# Altium schematic sheet 功耗测试工装原理图1.SchDoc
size A3
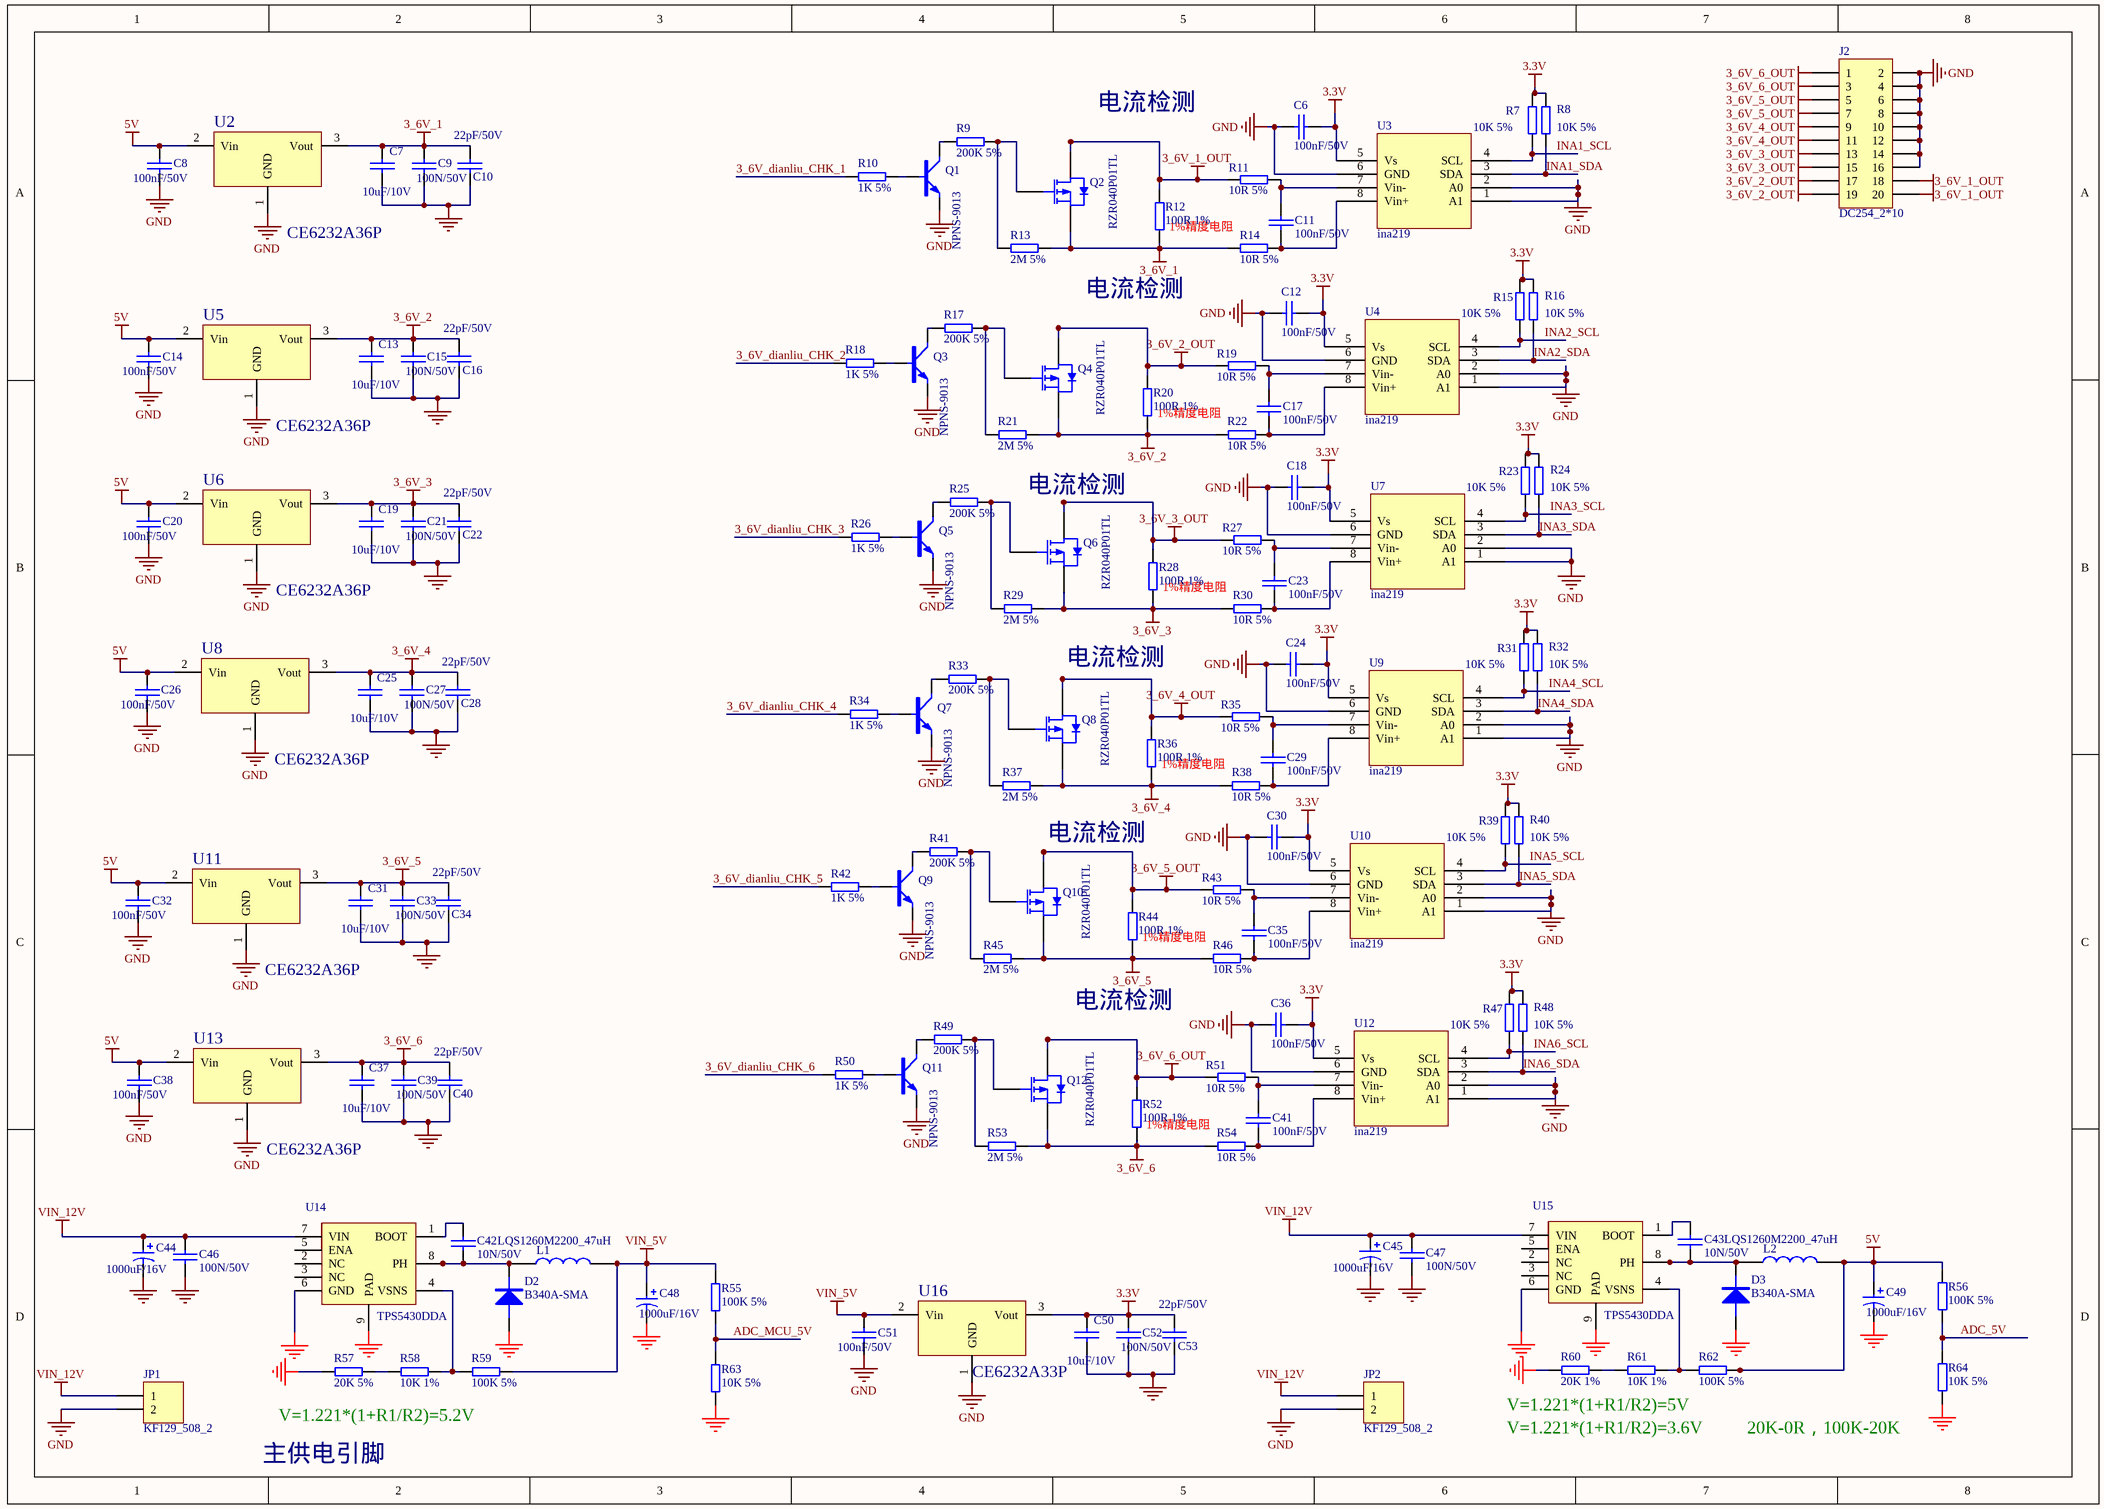
[diagram p0: 功耗测试工装原理图1.SchDoc]

## Parts
C6  100nF/50V  [CAP0603]
C7  10uF/10V  [CAP0603]
C8  100nF/50V  [CAP0603]
C9  100N/50V  [CAP0603]
C10  22pF/50V  [CAP0603]
C11  100nF/50V  [CAP0603]
C12  100nF/50V  [CAP0603]
C13  10uF/10V  [CAP0603]
C14  100nF/50V  [CAP0603]
C15  100N/50V  [CAP0603]
C16  22pF/50V  [CAP0603]
C17  100nF/50V  [CAP0603]
C18  100nF/50V  [CAP0603]
C19  10uF/10V  [CAP0603]
C20  100nF/50V  [CAP0603]
C21  100N/50V  [CAP0603]
C22  22pF/50V  [CAP0603]
C23  100nF/50V  [CAP0603]
C24  100nF/50V  [CAP0603]
C25  10uF/10V  [CAP0603]
C26  100nF/50V  [CAP0603]
C27  100N/50V  [CAP0603]
C28  22pF/50V  [CAP0603]
C29  100nF/50V  [CAP0603]
C30  100nF/50V  [CAP0603]
C31  10uF/10V  [CAP0603]
C32  100nF/50V  [CAP0603]
C33  100N/50V  [CAP0603]
C34  22pF/50V  [CAP0603]
C35  100nF/50V  [CAP0603]
C36  100nF/50V  [CAP0603]
C37  10uF/10V  [CAP0603]
C38  100nF/50V  [CAP0603]
C39  100N/50V  [CAP0603]
C40  22pF/50V  [CAP0603]
C41  100nF/50V  [CAP0603]
C42  10N/50V  [CAP0603]
C43  10N/50V  [CAP0603]
C44  1000uF/16V  [CAPPC_350_800_1600]
C45  1000uF/16V  [CAPPC_350_800_1600]
C46  100N/50V  [CAP0603]
C47  100N/50V  [CAP0603]
C48  1000uF/16V  [CAPPC_350_800_1600]
C49  1000uF/16V  [CAPPC_350_800_1600]
C50  10uF/10V  [CAP0603]
C51  100nF/50V  [CAP0603]
C52  100N/50V  [CAP0603]
C53  22pF/50V  [CAP0603]
D2  B340A-SMA  [DO-214AC]
D3  B340A-SMA  [DO-214AC]
J2  DC254_2*10  [DC254_2*10]
JP1  KF129_508_2  [KF129_508_2]
JP2  KF129_508_2  [KF129_508_2]
L1  LQS1260M2200_47uH  [LQS1212]
L2  LQS1260M2200_47uH  [LQS1212]
Q1  NPNS-9013  [SOT-23]
Q2  RZR040P01TL  [SOT-23]
Q3  NPNS-9013  [SOT-23]
Q4  RZR040P01TL  [SOT-23]
Q5  NPNS-9013  [SOT-23]
Q6  RZR040P01TL  [SOT-23]
Q7  NPNS-9013  [SOT-23]
Q8  RZR040P01TL  [SOT-23]
Q9  NPNS-9013  [SOT-23]
Q10  RZR040P01TL  [SOT-23]
Q11  NPNS-9013  [SOT-23]
Q12  RZR040P01TL  [SOT-23]
R7  10K 5%  [RES0603]
R8  10K 5%  [RES0603]
R9  200K 5%  [RES0603]
R10  1K 5%  [RES0603]
R11  10R 5%  [RES0603]
R12  100R 1%  [RES0603]
R13  2M 5%  [RES0603]
R14  10R 5%  [RES0603]
R15  10K 5%  [RES0603]
R16  10K 5%  [RES0603]
R17  200K 5%  [RES0603]
R18  1K 5%  [RES0603]
R19  10R 5%  [RES0603]
R20  100R 1%  [RES0603]
R21  2M 5%  [RES0603]
R22  10R 5%  [RES0603]
R23  10K 5%  [RES0603]
R24  10K 5%  [RES0603]
R25  200K 5%  [RES0603]
R26  1K 5%  [RES0603]
R27  10R 5%  [RES0603]
R28  100R 1%  [RES0603]
R29  2M 5%  [RES0603]
R30  10R 5%  [RES0603]
R31  10K 5%  [RES0603]
R32  10K 5%  [RES0603]
R33  200K 5%  [RES0603]
R34  1K 5%  [RES0603]
R35  10R 5%  [RES0603]
R36  100R 1%  [RES0603]
R37  2M 5%  [RES0603]
R38  10R 5%  [RES0603]
R39  10K 5%  [RES0603]
R40  10K 5%  [RES0603]
R41  200K 5%  [RES0603]
R42  1K 5%  [RES0603]
R43  10R 5%  [RES0603]
R44  100R 1%  [RES0603]
R45  2M 5%  [RES0603]
R46  10R 5%  [RES0603]
R47  10K 5%  [RES0603]
R48  10K 5%  [RES0603]
R49  200K 5%  [RES0603]
R50  1K 5%  [RES0603]
R51  10R 5%  [RES0603]
R52  100R 1%  [RES0603]
R53  2M 5%  [RES0603]
R54  10R 5%  [RES0603]
R55  100K 5%  [RES0603]
R56  100K 5%  [RES0603]
R57  20K 5%  [RES0603]
R58  10K 1%  [RES0603]
R59  100K 5%  [RES0603]
R60  20K 1%  [RES0603]
R61  10K 1%  [RES0603]
R62  100K 5%  [RES0603]
R63  10K 5%  [RES0603]
R64  10K 5%  [RES0603]
U2  CE6232A36P  [SOT-89]
U3  ina219  [SO-8]
U4  ina219  [SO-8]
U5  CE6232A36P  [SOT-89]
U6  CE6232A36P  [SOT-89]
U7  ina219  [SO-8]
U8  CE6232A36P  [SOT-89]
U9  ina219  [SO-8]
U10  ina219  [SO-8]
U11  CE6232A36P  [SOT-89]
U12  ina219  [SO-8]
U13  CE6232A36P  [SOT-89]
U14  TPS5430DDA  [SOP-8-P]
U15  TPS5430DDA  [SOP-8-P]
U16  CE6232A33P  [SOT-89]

## Nets
3.3V: C6.2 C12.2 C18.2 C24.2 C30.2 C36.2 C50.1 C52.1 C53.1 R7.1 R8.1 R15.1 R16.1 R23.1 R24.1 R31.1 R32.1 R39.1 R40.1 R47.1 R48.1 U3.5(Vs) U4.5(Vs) U7.5(Vs) U9.5(Vs) U10.5(Vs) U12.5(Vs) U16.3(Vout)
3_6V_1: C7.1 C9.1 C10.1 Q2.2(S) R12.1 R13.2 R14.1 U2.3(Vout)
3_6V_1_OUT: J2.18 J2.20 Q2.3(D) R11.1 R12.2
3_6V_2: C13.1 C15.1 C16.1 Q4.2(S) R20.1 R21.2 R22.1 U5.3(Vout)
3_6V_2_OUT: J2.17 J2.19 Q4.3(D) R19.1 R20.2
3_6V_3: C19.1 C21.1 C22.1 Q6.2(S) R28.1 R29.2 R30.1 U6.3(Vout)
3_6V_3_OUT: J2.13 J2.15 Q6.3(D) R27.1 R28.2
3_6V_4: C25.1 C27.1 C28.1 Q8.2(S) R36.1 R37.2 R38.1 U8.3(Vout)
3_6V_4_OUT: J2.9 J2.11 Q8.3(D) R35.1 R36.2
3_6V_5: C31.1 C33.1 C34.1 Q10.2(S) R44.1 R45.2 R46.1 U11.3(Vout)
3_6V_5_OUT: J2.5 J2.7 Q10.3(D) R43.1 R44.2
3_6V_6: C37.1 C39.1 C40.1 Q12.2(S) R52.1 R53.2 R54.1 U13.3(Vout)
3_6V_6_OUT: J2.1 J2.3 Q12.3(D) R51.1 R52.2
5V: C8.1 C14.1 C20.1 C26.1 C32.1 C38.1 C49.1 L2.2 R56.2 R62.2 U2.2(Vin) U5.2(Vin) U6.2(Vin) U8.2(Vin) U11.2(Vin) U13.2(Vin)
GND: C6.1 C7.2 C8.2 C9.2 C10.2 C12.1 C13.2 C14.2 C15.2 C16.2 C18.1 C19.2 C20.2 C21.2 C22.2 C24.1 C25.2 C26.2 C27.2 C28.2 C30.1 C31.2 C32.2 C33.2 C34.2 C36.1 C37.2 C38.2 C39.2 C40.2 C44.2 C45.2 C46.2 C47.2 C48.2 C49.2 C50.2 C51.2 C52.2 C53.2 D2.1 D3.1 J2.2 J2.4 J2.6 J2.8 J2.10 J2.12 J2.14 J2.16 JP1.2 JP2.2 Q1.2(E) Q3.2(E) Q5.2(E) Q7.2(E) Q9.2(E) Q11.2(E) R57.1 R60.1 R63.1 R64.1 U2.1(GND) U3.1(A1) U3.2(A0) U3.6(GND) U4.1(A1) U4.2(A0) U4.6(GND) U5.1(GND) U6.1(GND) U7.1(A1) U7.2(A0) U7.6(GND) U8.1(GND) U9.1(A1) U9.2(A0) U9.6(GND) U10.1(A1) U10.2(A0) U10.6(GND) U11.1(GND) U12.1(A1) U12.2(A0) U12.6(GND) U13.1(GND) U14.6(GND) U14.9(PAD) U15.6(GND) U15.9(PAD) U16.1(GND)
VIN_5V: C48.1 C51.1 L1.2 R55.2 R59.2 U16.2(Vin)
VIN_12V: C44.1 C45.1 C46.1 C47.1 JP1.1 JP2.1 U14.7(VIN) U15.7(VIN)
3_6V_dianliu_CHK_1: R10.2
3_6V_dianliu_CHK_2: R18.2
3_6V_dianliu_CHK_3: R26.2
3_6V_dianliu_CHK_4: R34.2
3_6V_dianliu_CHK_5: R42.2
3_6V_dianliu_CHK_6: R50.2
ADC_5V: R56.1 R64.2
ADC_MCU_5V: R55.1 R63.2
INA1_SCL: R7.2 U3.4(SCL)
INA1_SDA: R8.2 U3.3(SDA)
INA2_SCL: R15.2 U4.4(SCL)
INA2_SDA: R16.2 U4.3(SDA)
INA3_SCL: R23.2 U7.4(SCL)
INA3_SDA: R24.2 U7.3(SDA)
INA4_SCL: R31.2 U9.4(SCL)
INA4_SDA: R32.2 U9.3(SDA)
INA5_SCL: R39.2 U10.4(SCL)
INA5_SDA: R40.2 U10.3(SDA)
INA6_SCL: R47.2 U12.4(SCL)
INA6_SDA: R48.2 U12.3(SDA)
NetC11_1: C11.1 R11.2 U3.7(Vin-)
NetC11_2: C11.2 R14.2 U3.8(Vin+)
NetC17_1: C17.1 R19.2 U4.7(Vin-)
NetC17_2: C17.2 R22.2 U4.8(Vin+)
NetC23_1: C23.1 R27.2 U7.7(Vin-)
NetC23_2: C23.2 R30.2 U7.8(Vin+)
NetC29_1: C29.1 R35.2 U9.7(Vin-)
NetC29_2: C29.2 R38.2 U9.8(Vin+)
NetC35_1: C35.1 R43.2 U10.7(Vin-)
NetC35_2: C35.2 R46.2 U10.8(Vin+)
NetC41_1: C41.1 R51.2 U12.7(Vin-)
NetC41_2: C41.2 R54.2 U12.8(Vin+)
NetC42_1: C42.1 D2.2 L1.1 U14.8(PH)
NetC42_2: C42.2 U14.1(BOOT)
NetC43_1: C43.1 D3.2 L2.1 U15.8(PH)
NetC43_2: C43.2 U15.1(BOOT)
NetQ1_1: Q1.1(B) R10.1
NetQ1_3: Q1.3(C) R9.2
NetQ2_1: Q2.1(G) R9.1 R13.1
NetQ3_1: Q3.1(B) R18.1
NetQ3_3: Q3.3(C) R17.2
NetQ4_1: Q4.1(G) R17.1 R21.1
NetQ5_1: Q5.1(B) R26.1
NetQ5_3: Q5.3(C) R25.2
NetQ6_1: Q6.1(G) R25.1 R29.1
NetQ7_1: Q7.1(B) R34.1
NetQ7_3: Q7.3(C) R33.2
NetQ8_1: Q8.1(G) R33.1 R37.1
NetQ9_1: Q9.1(B) R42.1
NetQ9_3: Q9.3(C) R41.2
NetQ10_1: Q10.1(G) R41.1 R45.1
NetQ11_1: Q11.1(B) R50.1
NetQ11_3: Q11.3(C) R49.2
NetQ12_1: Q12.1(G) R49.1 R53.1
NetR57_2: R57.2 R58.1
NetR58_2: R58.2 R59.1 U14.4(VSNS)
NetR60_2: R60.2 R61.1
NetR61_2: R61.2 R62.1 U15.4(VSNS)

Not connected (* = marked no-connect by the designer): U14 2(NC) 3(NC) 5(ENA); U15 2(NC) 3(NC) 5(ENA)

## Notes on the sheet
- 电流检测
- (near R12) 1%精度电阻
- (near R20) 1%精度电阻
- (near R28) 1%精度电阻
- (near R36) 1%精度电阻
- (near R44) 1%精度电阻
- (near R52) 1%精度电阻
- 主供电引脚
- V=1.221*(1+R1/R2)=5.2V
- V=1.221*(1+R1/R2)=5V
- V=1.221*(1+R1/R2)=3.6V
- 20K-0R，100K-20K

## Library data of the parts
C6 C8 C11 C12 C14 C17 C18 C20 C23 C24 C26 C29 C30 C32 C35 C36 C38 C41 C51 = 101020103-0021: 104pF,50 V,±10%,0603,国巨,CC0603KRX7R9BB104; Part Name: 0603贴片电容; ID: 3; SMD/DIP: SMD; Part Number: 101020103-0021
C7 C13 C19 C25 C31 C37 C50 = 101020103-0026: 106pF,10 V,±10%,0603,村田,GRM188R61A106KE47D; Part Name: 0603贴片电容; ID: 8; SMD/DIP: SMD; Part Number: 101020103-0026
C9 C15 C21 C27 C33 C39 C46 C47 C52 = 101020103-0021: 100N/50V，±10%，0603; Part Name: 0603贴片电容; ID: 34; Part Number: 101020103-0021
C10 C16 C22 C28 C34 C40 C53 = 101020103-0009: 22pF,50 V,±5%,0603,国巨,CC0603JRNPO9BN22; Part Name: 0603贴片电容; ID: 16; SMD/DIP: SMD; Part Number: 101020103-0009
C42 C43 = 101020103-0007: 10N/50V，±10%，0603; Part Name: 0603贴片电容; ID: 35; Part Number: 101020103-0007
C44 C45 C48 C49 = 1010203-0029: 1000uF,16 V,±20%,8*20mm,Rubycon,16ZLH1000M; Part Name: 电解电容; ID: 2; SMD/DIP: DIP; Part Number: 1010203-0029
D2 D3 = 101040101-0014: Part Name: 贴片肖特基; ID: 24; Part Number: 101040101-0014
J2 = 1010902-0139: DC2 2.54mm 2x10pin,2.54mm间距，2x10pin，32×8.55×27.5mm,母头,双排,双排牛角座; Part Name: DC牛角座; ID: 4; SMD/DIP: DIP; Part Number: 1010902-0139
JP1 JP2 = 1010904-0015: KF129-2P,螺丝紧固,2,ABS,松涛; Part Name: 接线端子; ID: 7; SMD/DIP: DIP; Part Number: 1010904-0015
L1 L2 = 1010302-0007: 47uH/2.2A,±20%，0.072Ω，L1200X1200X600; Part Name: 贴片电感; ID: 3; Part Number: 1010302-0007
Q1 Q3 Q5 Q7 Q9 Q11 = 101040201-0002: 9013,NPN,SOT-23,长电,S9013; Part Name: 贴片三极管; ID: 15; SMD/DIP: SMD; Part Number: 101040201-0002
Q2 Q4 Q6 Q8 Q10 Q12 = 101040201-0010: RZR040P01TL；1.5v导通,P-MOS,SOT-23,罗姆,RZR040P01TL; Part Name: PMOS管; ID: 18; SMD/DIP: SMD; Part Number: 101040201-0010
R7 R8 R15 R16 R23 R24 R31 R32 R39 R40 R47 R48 = 101010103-0003: 国巨,±5%,0603,,155 ℃,-55 ℃,RC0603JR-0710KL,无铅,200 ppm/℃,1/10W,,10K; Part Name: 0603贴片电阻; ID: 7; SMD/DIP: SMD; Part Number: 101010103-0003
R9 R17 R25 R33 R41 R49 = 101010103-0034: 200K,±5%,1/10W,0603,国巨,RC0603JR-07200KL; Part Name: 0603贴片电阻; ID: 13; SMD/DIP: SMD; Part Number: 101010103-0034
R10 R18 R26 R34 R42 R50 = 101010103-0008: 1K,±5%,1/10W,0603,国巨,RC0603JR-071KL; Part Name: 0603贴片电阻; ID: 10; SMD/DIP: SMD; Part Number: 101010103-0008
R11 R14 R19 R22 R27 R30 R35 R38 R43 R46 R51 R54 = 101010103-0017: 10R,±5%,1/10W,0603,国巨,RC0603JR-0710RL; Part Name: 0603贴片电阻; ID: 8; SMD/DIP: SMD; Part Number: 101010103-0017
R12 R20 R28 R36 R44 R52 = 101010103-0041: 100Ω,±1%,1/10W,0603,国巨股份有限公司,RC0603FR-07100RL; Part Name: 0603贴片电阻; ID: 4; SMD/DIP: SMD; Part Number: 101010103-0041
R13 R21 R29 R37 R45 R53 = 101010103-0025: 国巨,±5%,0603,,155 ℃,-55 ℃,RC0603JR-072ML,含铅,100 ppm/℃,1/10W,,2M; Part Name: 0603贴片电阻; ID: 20; SMD/DIP: SMD; Part Number: 101010103-0025
R55 R56 R63 R64 = 101010103-0005: 100K±5%,1/10W,0603; Part Name: 0603贴片电阻; ID: 30; Part Number: 101010103-0005
R57 = 101010103-0004: 国巨,±5%,0603,,155 ℃,-55 ℃,RC0603JR-0720KL,无铅,200 ppm/℃,1/10W,,20K; Part Name: 0603贴片电阻; ID: 15; SMD/DIP: SMD; Part Number: 101010103-0004
R58 R61 = 101010103-0053: 8.2k±1%,1/10W,0603; Part Name: 0603贴片电阻; ID: 142; Part Number: 101010103-0053
R59 R62 = 101010103-0005: 国巨,±5%,0603,,155 ℃,-55 ℃,RC0603JR-07100KL,无铅,100 ppm/℃,1/10W,,100K; Part Name: 0603贴片电阻; ID: 3; SMD/DIP: SMD; Part Number: 101010103-0005
R60 = 101010103-0048: 20K,±1%,1/10W,0603,国巨,RC0603FR-0720KL; Part Name: 0603贴片电阻; ID: 14; SMD/DIP: SMD; Part Number: 101010103-0048
U2 U5 U6 U8 U11 U13 = 1010503-0031: CE6232A36P,CE6232A36P,SOT89-3,8 V,1.8 V,0.11 V,3.6 V,600mA,0.8 uA,南京芯力微电子有限公司; Part Name: 贴片稳压器; ID: 30; SMD/DIP: SMD; Part Number: 1010503-0031
U3 U4 U7 U9 U10 U12 = Component_2
U14 U15 = 101050101-0053: TPS5430DDA,SOP8,TI,TPS5430DDA; Part Name: 电源芯片; ID: 9; SMD/DIP: SMD; Part Number: 101050101-0053
U16 = 1010503-0029: CE6232-3.3,CE6232-3.3,SOT89-3,8V,1.8V,0.11V,3.3V,300mA,0.8uA,南京芯力微电子有限公司; Part Name: 线性稳压芯片; ID: 5; SMD/DIP: SMD; Part Number: 1010503-0029